# Altium schematic sheet WL_1.2G.SchDoc
size 420 x 297 mm; SheetNumber: 2; SheetTotal: 9
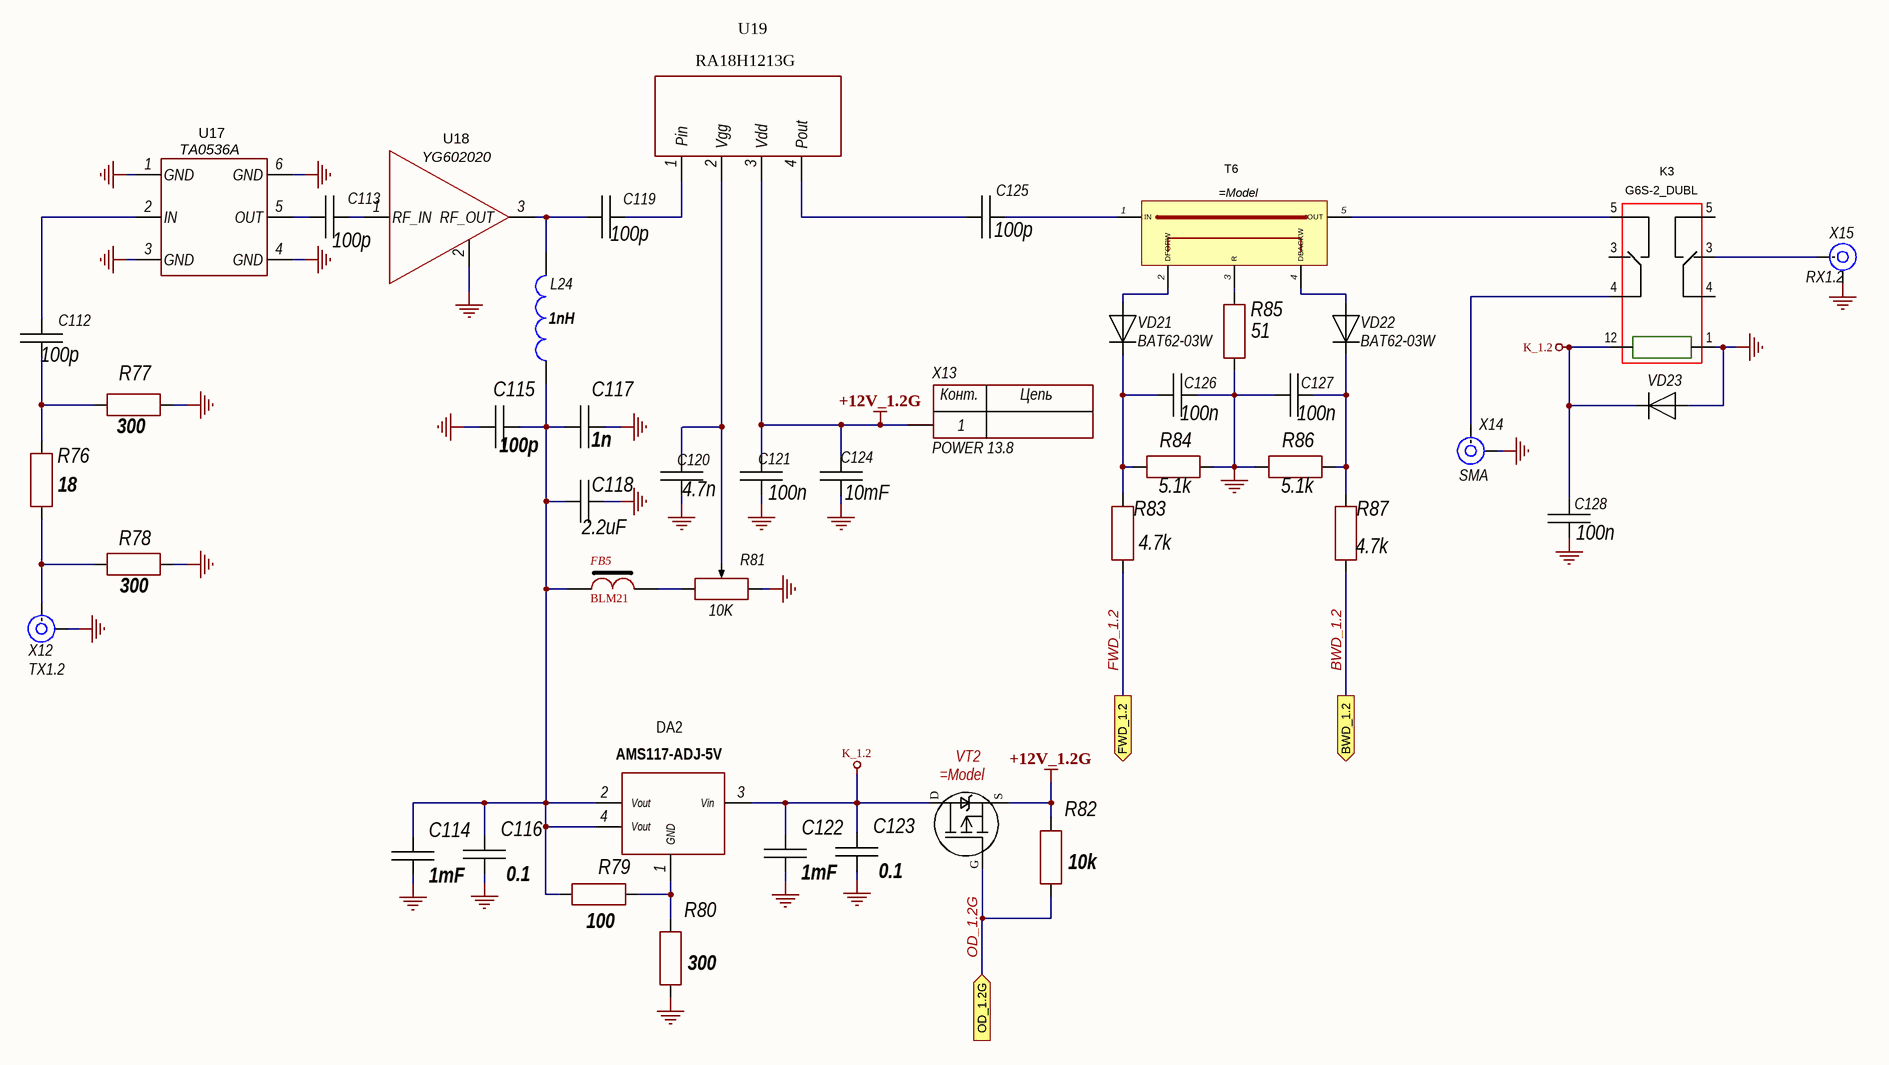
[diagram p0: WL_1.2G.SchDoc]

## Parts
C112  100p  [CH0603C]
C113  100p  [CH0603C]
C114  1mF  [CH0603C]
C115  100p  [CH0603C]
C116  0.1  [CH0805C]
C117  1n  [CH0603C]
C118  2.2uF  [CH0603C]
C119  100p  [CH0805C]
C120  4.7n  [CH0805C]
C121  100n  [CH1206C]
C122  1mF  [CH0805C]
C123  0.1  [CH0805C]
C124  10mF  [CH1206C]
C125  100p  [CH1210C]
C126  100n  [CH0603C]
C127  100n  [CH0603C]
C128  100n  [CH0805C]
DA2  AMS117-ADJ-5V  [SOT223]
FB5  BLM21  [CH0805L]
K3  G6S-2_DUBL  [G6S-2_DUBL]
L24  1nH  [katuhka]
R76  18  [CH0603R]
R77  300  [CH0603R]
R78  300  [CH0603R]
R79  100  [CH0805R]
R80  300  [CH0805R]
R81  10K  [RES: 3296W]
R82  10k  [CH0805R]
R83  4.7k  [CH0603R]
R84  5.1k  [CH0603R]
R85  51  [CH1206R]
R86  5.1k  [CH0603R]
R87  4.7k  [CH0603R]
T6  (no value)  [SWR_D]
U17  TA0536A  [MA08803]
U18  YG602020  [SOT89_123]
U19  RA18H1213G  [RA80H1415M1 - duplicate]
VD21  BAT62-03W  [1N4148]
VD22  BAT62-03W  [1N4148]
VD23  (no value)  [1N4148]
VT2  (no value)  [SOT23_132]
X12  TX1.2  [CON: u.Fl]
X13  POWER 13.8  [CON: KNIFE_5MM]
X14  SMA  [CON: SMA]
X15  RX1.2  [CON: u.Fl]

## Ports
BWD_1.2 (out), FWD_1.2 (out), OD_1.2G (in)

## Nets
+12V_1.2G: C121.2 C124.2 R82.2 U19.3(Vdd) VT2.2(Исток) X13.1
GND: C114.1 C115.2 C116.1 C117.2 C118.2 C120.1 C121.1 C122.1 C123.1 C124.1 C126.1 C127.2 C128.2 K3.1 R77.1 R78.1 R80.1 R81.3 R84.1 R85.1 R86.2 U17.1(GND) U17.3(GND) U17.4(GND) U17.6(GND) U18.2(GND) VD23.1 X12.2(IN) X14.2(IN) X15.2(IN)
K_1.2: C122.2 C123.2 C128.1 DA2.3(Vin) K3.12 VD23.2 VT2.3(Сток)
BWD_1.2: R87.2 ; port BWD_1.2
FWD_1.2: R83.2 ; port FWD_1.2
OD_1.2G: R82.1 VT2.1(Затвор(Gate)) ; port OD_1.2G
NetC112_1: C112.1 U17.2(IN)
NetC112_2: C112.2 R76.1 R77.2
NetC113_1: C113.1 U18.1(RF_IN)
NetC113_2: C113.2 U17.5(OUT)
NetC114_2: C114.2 C115.1 C116.2 C117.1 C118.1 DA2.2(Vout) DA2.4(Vout) FB5.1 L24.2 R79.2
NetC119_1: C119.1 U19.1(Pin)
NetC119_2: C119.2 L24.1 U18.3(RF_OUT)
NetC120_2: C120.2 R81.2 U19.2(Vgg)
NetC125_1: C125.1 T6.1(IN)
NetC125_2: C125.2 U19.4(Pout)
NetC126_2: C126.2 R83.1 R84.2 VD21.2
NetC127_1: C127.1 R86.1 R87.1 VD22.2
NetDA2_1: DA2.1(GND) R79.1 R80.2
NetFB5_2: FB5.2 R81.1
NetK3_3: K3.3 X15.1(IN)
NetK3_4: K3.4 X14.1(IN)
NetK3_5: K3.5 T6.5(OUT)
NetR76_2: R76.2 R78.2 X12.1(IN)
NetR85_2: R85.2 T6.3(R)
NetT6_2: T6.2(DFORW) VD21.1
NetT6_4: T6.4(DBACKW) VD22.1

## Notes on the sheet
- Подп. и дата
- Инв. № дубл.
- Взам. инв. №
- Инв. № подл.
- Изм.
- Лист
- № докум.
- Подп.
- Дата
- 2.106-A3
- Копировал
- Формат А3
- (in symbol 1-Connector) Конт.; Цепь
- (in symbol P-KANAL) D; S; G

## Library data of the parts
C112-C128 = Capacitor: Manufacturer: *; Model: *; HelpURL: *; ComponentKind: *; Value: *
DA2 = AMS117
FB5 = FB-1
L24 = Inductor ring: Value: {Value}; Model: *; ComponentKind: *; Manufacturer: *; HelpURL: *
R76-R80 R82-R87 = Resistor: Manufacturer: *; Model: *; HelpURL: *; ComponentKind: *; Value: *
R81 = ADJ resistor: Manufacturer: *; Model: *; HelpURL: *; ComponentKind: *; Value: *
T6 = VHF_KSV1
U17 = TAU692
U19 = RA80H1415M1
VD21-VD23 = Diod: ComponentKind: *; Manufacturer: *; Model: *; HelpURL: *
VT2 = P-KANAL
X12 X14 X15 = SMA: RF; Model: *; Manufacturer: *; HelpURL: *; ComponentKind: *
X13 = 1-Connector: Model: *; Manufacturer: *; HelpURL: *; ComponentKind: *